# EAGLE design 360 led stick 5 layer (EAGLE 9.6.2)
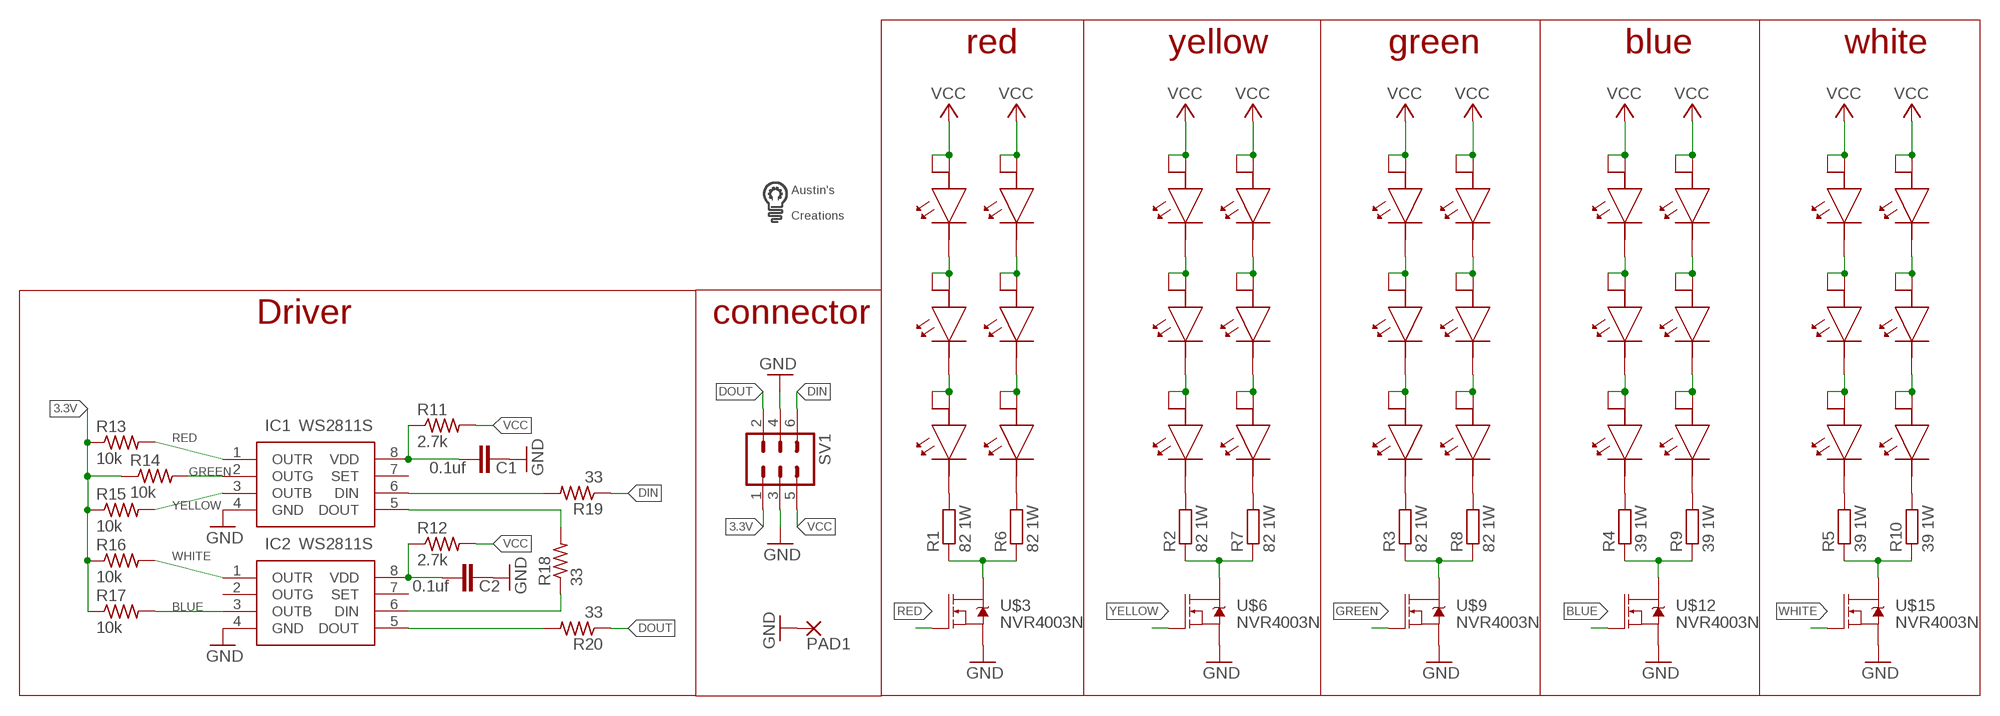
[diagram p0: schematic, sheet 1]

## Parts
C1  0.1uf  C-EUC0603K  [C0603K]
C2  0.1uf  C-EUC0603K  [C0603K]
IC1  WS2811S  [SOIC127P600X175-8N]
IC2  WS2811S  [SOIC127P600X175-8N]
PAD1  WIREPADSMD1,27-254  [SMD1,27-2,54]
R1  82 1W  R-EU_R1210  [R1210]
R2  82 1W  R-EU_R1210  [R1210]
R3  82 1W  R-EU_R1210  [R1210]
R4  39 1W  R-EU_R1210  [R1210]
R5  39 1W  R-EU_R1210  [R1210]
R6  82 1W  R-EU_R1210  [R1210]
R7  82 1W  R-EU_R1210  [R1210]
R8  82 1W  R-EU_R1210  [R1210]
R9  39 1W  R-EU_R1210  [R1210]
R10  39 1W  R-EU_R1210  [R1210]
R11  2.7k  R-US_R0603  [R0603]
R12  2.7k  R-US_R0603  [R0603]
R13  10k  R-US_R0603  [R0603]
R14  10k  R-US_R0603  [R0603]
R15  10k  R-US_R0603  [R0603]
R16  10k  R-US_R0603  [R0603]
R17  10k  R-US_R0603  [R0603]
R18  33  R-US_R0603  [R0603]
R19  33  R-US_R0603  [R0603]
R20  33  R-US_R0603  [R0603]
SV1  MA03-2  [MA03-2]
U$1  5730LED  [5730LED]
U$2  5730LED  [5730LED]
U$3  NVR4003N  [SOT23]
U$4  5730LED  [5730LED]
U$5  5730LED  [5730LED]
U$6  NVR4003N  [SOT23]
U$7  5730LED  [5730LED]
U$8  5730LED  [5730LED]
U$9  NVR4003N  [SOT23]
U$10  5730LED  [5730LED]
U$11  5730LED  [5730LED]
U$12  NVR4003N  [SOT23]
U$13  5730LED  [5730LED]
U$14  5730LED  [5730LED]
U$15  NVR4003N  [SOT23]
U$16  5730LED  [5730LED]
U$17  5730LED  [5730LED]
U$18  5730LED  [5730LED]
U$19  5730LED  [5730LED]
U$20  5730LED  [5730LED]
U$21  LOGO  [LOGO]
U$22  5730LED  [5730LED]
U$23  5730LED  [5730LED]
U$24  5730LED  [5730LED]
U$25  5730LED  [5730LED]
U$26  5730LED  [5730LED]
U$27  5730LED  [5730LED]
U$28  5730LED  [5730LED]
U$29  5730LED  [5730LED]
U$30  5730LED  [5730LED]
U$31  5730LED  [5730LED]
U$32  5730LED  [5730LED]
U$33  5730LED  [5730LED]
U$34  5730LED  [5730LED]
U$35  5730LED  [5730LED]
U$36  5730LED  [5730LED]

## Nets
3.3V: R13.1 R14.1 R15.1 R16.1 R17.1 SV1.1
BLUE: IC2.3(OUTB) R17.2 U$12.2(G)
DIN: R19.1 SV1.6
DOUT: R20.1 SV1.2
GND: C1.1 C2.1 IC1.4(GND) IC2.4(GND) PAD1.1(P) SV1.3 SV1.4 U$3.3(S) U$6.3(S) U$9.3(S) U$12.3(S) U$15.3(S)
GREEN: IC1.2(OUTG) R14.2 U$9.2(G)
N$1: U$1.P$2 U$2.P$1 U$2.P$3
N$2: U$2.P$2 U$4.P$1 U$4.P$3
N$3: R1.2 U$4.P$2
N$4: U$5.P$2 U$7.P$1 U$7.P$3
N$5: U$7.P$2 U$8.P$1 U$8.P$3
N$6: R2.2 U$8.P$2
N$7: U$10.P$2 U$11.P$1 U$11.P$3
N$8: U$11.P$2 U$13.P$1 U$13.P$3
N$9: R3.2 U$13.P$2
N$10: U$14.P$2 U$16.P$1 U$16.P$3
N$11: U$16.P$2 U$17.P$1 U$17.P$3
N$12: R4.2 U$17.P$2
N$13: U$18.P$2 U$19.P$1 U$19.P$3
N$14: U$19.P$2 U$20.P$1 U$20.P$3
N$15: R5.2 U$20.P$2
N$16: R1.1 R6.1 U$3.1(D)
N$17: R2.1 R7.1 U$6.1(D)
N$18: R3.1 R8.1 U$9.1(D)
N$19: R4.1 R9.1 U$12.1(D)
N$20: R5.1 R10.1 U$15.1(D)
N$21: U$22.P$2 U$23.P$1 U$23.P$3
N$22: U$23.P$2 U$24.P$1 U$24.P$3
N$23: R6.2 U$24.P$2
N$24: U$25.P$2 U$26.P$1 U$26.P$3
N$25: U$26.P$2 U$27.P$1 U$27.P$3
N$26: R7.2 U$27.P$2
N$27: U$28.P$2 U$29.P$1 U$29.P$3
N$28: U$29.P$2 U$30.P$1 U$30.P$3
N$29: R8.2 U$30.P$2
N$30: U$31.P$2 U$32.P$1 U$32.P$3
N$31: U$32.P$2 U$33.P$1 U$33.P$3
N$32: R9.2 U$33.P$2
N$33: U$34.P$2 U$35.P$1 U$35.P$3
N$34: U$35.P$2 U$36.P$1 U$36.P$3
N$35: R10.2 U$36.P$2
N$39: C1.2 IC1.8(VDD) R11.1
N$40: IC1.6(DIN) R19.2
N$41: IC2.6(DIN) R18.1
N$42: C2.2 IC2.8(VDD) R12.1
N$45: IC1.5(DOUT) R18.2
N$46: IC2.5(DOUT) R20.2
RED: IC1.1(OUTR) R13.2 U$3.2(G)
VCC: R11.2 R12.2 SV1.5 U$1.P$1 U$1.P$3 U$5.P$1 U$5.P$3 U$10.P$1 U$10.P$3 U$14.P$1 U$14.P$3 U$18.P$1 U$18.P$3 U$22.P$1 U$22.P$3 U$25.P$1 U$25.P$3 U$28.P$1 U$28.P$3 U$31.P$1 U$31.P$3 U$34.P$1 U$34.P$3
WHITE: IC2.1(OUTR) R16.2 U$15.2(G)
YELLOW: IC1.3(OUTB) R15.2 U$6.2(G)
Unconnected: IC1.7(SET) IC2.2(OUTG) IC2.7(SET)

## Notes on the sheet
- red | yellow | green | blue | white
- Driver | connector

## Library data of the parts
C1 C2 = rcl:C-EU: CAPACITOR, European symbol; SPICEPREFIX: C
IC1 IC2 = SamacSys_Parts:WS2811S: RGB led driver Source: Datasheet <https://cdn-shop.adafruit.com/datasheets/WS2811.pdf>; DESCRIPTION: RGB led driver; HEIGHT: 1.75mm; MANUFACTURER_NAME: Worldsemi; MANUFACTURER_PART_NUMBER: ws2811s
PAD1 = wirepad:WIREPAD: Wire PAD connect wire on PCB
R1-R10 = resistor:R-EU_: RESISTOR, European symbol
R11-R20 = resistor:R-US_: RESISTOR, American symbol
SV1 = con-lstb:MA03-2: PIN HEADER; OC_FARNELL: unknown; OC_NEWARK: unknown
U$1 U$2 U$4 U$5 U$7 U$8 U$10 U$11 U$13 U$14 U$16-U$20 U$22-U$36 = custom parts:5730LED
U$3 U$6 U$9 U$12 U$15 = custom parts:NVR4003N
U$21 = custom parts:LOGO

## Board
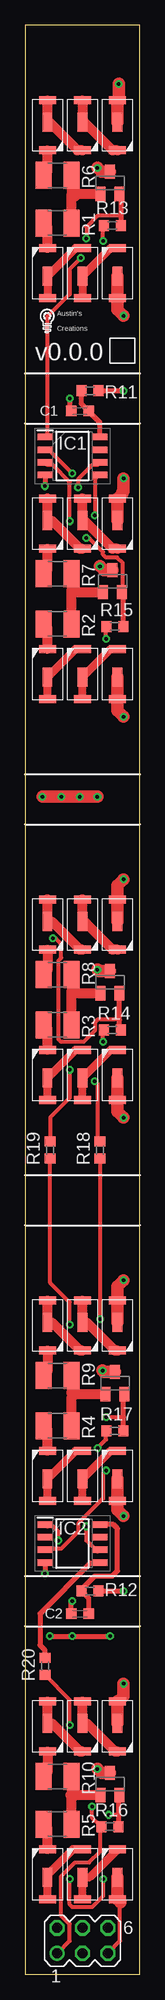
[diagram p1: board, top side]
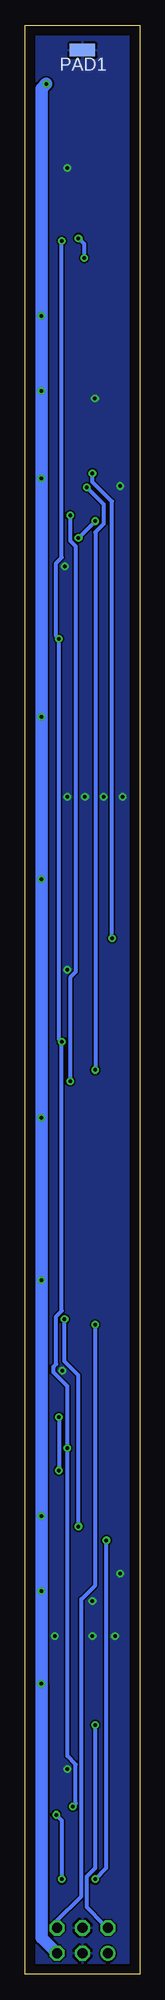
[diagram p2: board, bottom side, seen from below]

Size 11.5 x 194.5 mm. Coordinates in mm from the lower left corner, seen from the top.
Outline: 11.5,0 11.5,194.5 0,194.5 0,0 11.5,0
Copper layers (1*16): Top 0.035mm / dielectric 1.5mm / Bottom 0.035mm
Design rules "default *": minimum track width 16mil, minimum drill 0.35mm, track to track 6mil, track to pad 6mil, pad to pad 6mil, via to via 6mil, smd to smd 6mil, copper to edge 40mil, drill to drill 6mil, minimum pad ring 10mil, minimum via ring 8mil, stop-mask expansion 4mil, vias tented up to drill 0mil, thermal gap 10mil

### Footprints (pad centres in the part's own frame; a part is rotated, then mirrored left to right if it is on the bottom)
C0603K = smd 1.05 x 1.08: 1 -0.875,0; 2 0.875,0
SOIC127P600X175-8N = smd 1.55 x 0.65: 1 -2.725,1.905; 2 -2.725,0.635; 3 -2.725,-0.635; 4 -2.725,-1.905; 5 2.725,-1.905; 6 2.725,-0.635; 7 2.725,0.635; 8 2.725,1.905
SMD1,27-2,54 = smd 1.27 x 2.54: 1 0,0
R1210 = smd 1.6 x 2.7: 1 -1.4,0; 2 1.4,0
R0603 = smd 1 x 1.1: 1 -0.85,0; 2 0.85,0
MA03-2 = drill 1.016: 1 -2.54,-1.27 | drill 1.016 octagon: 2 -2.54,1.27; 3 0,-1.27; 4 0,1.27; 5 2.54,-1.27; 6 2.54,1.27
5730LED = smd 0.813 x 1.676: P$1 -2.5,0; P$2 2.5,0 | smd 1.93 x 0.965: P$3 -0.3,0
SOT23 = smd 1 x 1.4: 1 -0.95,-1.1; 2 0.95,-1.1; 3 0,1.1

### Placement (x,y rotation side)
C1  5.5,156 0 top
C2  5.5,36 0 top
IC1  4.75,151.5 0 top
IC2  4.75,43 0 top
PAD1  5.75,192 90 bottom
R1  3.25,174.75 180 top
R2  3.25,134.75 180 top
R3  3.25,94.75 180 top
R4  3.25,54.75 180 top
R5  3.25,15 180 top
R6  3.25,179.5 180 top
R7  3.25,139.75 180 top
R8  3.25,99.75 180 top
R9  3.25,59.75 180 top
R10  3.25,19.75 180 top
R11  6.5,158 0 top
R12  6.5,38.25 0 top
R13  8.75,174.5 0 top
R14  8.75,94.25 0 top
R15  9,134.5 0 top
R16  8.5,14.75 0 top
R17  9,54.25 0 top
R18  7.5,82.25 90 top
R19  2.5,82.25 90 top
R20  2,30.75 90 top
SV1  5.75,3.38 0 top
U$1  9.25,169.75 90 top
U$2  5.75,169.75 90 top
U$3  8.5,178.75 0 top
U$4  2.25,169.75 90 top
U$5  9.25,129.75 90 top
U$6  8.75,139 0 top
U$7  5.75,129.75 90 top
U$8  2.25,129.75 90 top
U$9  8.5,99 0 top
U$10  9.25,89.75 90 top
U$11  5.75,89.75 90 top
U$12  9,59 0 top
U$13  2.25,89.75 90 top
U$14  9.25,49.75 90 top
U$15  8.5,19 0 top
U$16  5.75,49.75 90 top
U$17  2.25,49.75 90 top
U$18  9.25,10 90 top
U$19  5.75,10 90 top
U$20  2.25,10 90 top
U$21  1.5,163.75 0 top
U$22  9.25,184.5 270 top
U$23  5.75,184.5 270 top
U$24  2.25,184.5 270 top
U$25  9.25,144.75 270 top
U$26  5.75,144.75 270 top
U$27  2.25,144.75 270 top
U$28  9.25,104.75 270 top
U$29  5.75,104.75 270 top
U$30  2.25,104.75 270 top
U$31  9.25,64.75 270 top
U$32  5.75,64.75 270 top
U$33  2.25,64.75 270 top
U$34  9.25,24.75 270 top
U$35  5.75,24.75 270 top
U$36  2.25,24.75 270 top

### Tracks (layer width: path | path; a pad name or v marks a point on that pad's centre or on a via)
3.3V  (via drill 0.35)
  Top 0.406: SV1.1 3.35,2.23 4.47,3.35 4.47,5.03 3.63,5.87 3.63,9.78 5.03,11.18 6.43,11.18 7.54,12.29 7.54,14.53 R16.1 7.54,14.81 6.71,15.65 v6.71,16.76 | v7.26,52.53 8.1,53.37 8.1,54.2 R17.1 | v7.82,93.04 7.82,94.16 R14.1 | v8.1,133.27 8.1,134.39 R15.1 | v7.82,172.95 7.82,174.35 R13.1
  Bottom 0.406: v6.71,16.76 6.43,17.04 6.43,20.95 7.26,21.79 v7.26,52.53 7.26,58.67 8.66,60.07 8.66,60.63 8.38,60.91 8.38,65.66 7.82,66.22 v7.82,93.04 8.1,93.32 v8.1,133.27 8.38,133.55 8.38,140.82 7.82,141.38 v7.82,172.95
BLUE  (via drill 0.35)
  Top 0.406: v8.1,50.29 7.82,50.01 7.82,47.5 5.31,44.98 5.31,44.15 3.63,42.47 2.23,42.47 IC2.3 | 9.85,55.6 v8.1,55.6
  Top 0.508: R17.2 9.85,55.6 9.85,57.8 U$12.2
  Bottom 0.406: v8.1,55.6 v8.1,50.29
DIN  (via drill 0.35)
  Top 0.406: v4.47,64.82 4.47,67.06 2.52,69.01 2.52,81.31 R19.1
  Bottom 0.406: v4.47,64.82 4.47,38.84 5.87,37.44 5.87,7.82 8.38,5.31 8.38,4.75 SV1.6
DOUT  (via drill 0.35)
  Top 0.406: v4.47,24.87 4.47,27.38 R20.1
  Bottom 0.406: v4.47,24.87 4.47,10.62 5.31,9.78 5.31,6.71 3.63,5.03 3.35,5.03 3.07,4.75 SV1.2
GND  (via drill 0.35)
  Top 0.508: IC1.4 2.02,148.53 v2,148.5 | C1.1 4.5,156.12 v4.5,157.25 | IC2.4 2.02,40.02 v2,40 | C2.1 4.62,37.12 v4.75,37.25 | v2.5,33.75 v4.75,33.75 v8.5,33.75
  Top 1.27: U$15.3 7.65,20.1 v7.25,20.5 | U$3.3 7.65,179.85 v7.25,180.25 | U$6.3 7.9,140.1 v7.5,140.5 | U$9.3 7.4,100.1 v7.25,100.25 | U$12.3 7.9,60.1 v7.75,60.25 | v1.75,117.5 v3.62,117.5 v5.5,117.5 v7.25,117.5
  pour Bottom: 0,194.5 0,0 11.5,0 11.5,194.5
GREEN  (via drill 0.35)
  Top 0.406: v4.75,149.76 2.52,151.99 2.23,151.99 IC1.2 | v2.79,103.38 3.07,103.38 3.63,102.82 3.63,101.42 3.35,101.14 3.35,93.32 3.63,93.04 5.87,93.04 6.99,94.16 6.99,95 7.26,95.28 9.45,95.28
  Top 0.508: R14.2 9.45,94.4 9.45,95.28 U$9.2
  Bottom 0.406: v4.75,149.76 4.75,148.92 2.79,146.96 v2.79,103.38
N$1
  Top 0.813: U$2.P$1 U$2.P$3 8.55,172.25 U$1.P$2
N$2
  Top 0.813: U$4.P$1 U$4.P$3 5.05,172.25 U$2.P$2
N$3
  Top 1.016: U$4.P$2 2.25,174.35 R1.2
N$4
  Top 0.813: U$7.P$1 U$7.P$3 8.55,132.25 U$5.P$2
N$5
  Top 0.813: U$8.P$1 U$8.P$3 5.05,132.25 U$7.P$2
N$6
  Top 1.016: U$8.P$2 2.25,134.35 R2.2
N$7
  Top 0.813: U$11.P$1 U$11.P$3 8.55,92.25 U$10.P$2
N$8
  Top 0.813: U$13.P$1 U$13.P$3 5.05,92.25 U$11.P$2
N$9
  Top 1.016: U$13.P$2 2.25,94.35 R3.2
N$10
  Top 0.813: U$16.P$1 U$16.P$3 8.55,52.25 U$14.P$2
N$11
  Top 0.813: U$17.P$1 U$17.P$3 5.05,52.25 U$16.P$2
N$12
  Top 1.016: U$17.P$2 2.25,54.35 R4.2
N$13
  Top 0.813: U$19.P$1 U$19.P$3 6.5,9.7 9.25,12.45 U$18.P$2
N$14
  Top 0.813: U$20.P$1 U$20.P$3 2.25,9.95 4.8,12.5 U$19.P$2
N$15
  Top 1.016: U$20.P$2 2.25,14.6 R5.2
N$16
  Top 1.016: 4.8,177.4 4.65,177.25 R1.1 | 4.8,177.4 5.05,177.4 5.3,177.65 U$3.1 | R6.1 4.65,177.55 4.8,177.4
N$17
  Top 1.016: 4.8,137.9 4.65,137.75 R2.1 | 4.8,137.9 U$6.1 | R7.1 4.65,138.05 4.8,137.9
N$18
  Top 1.016: R3.1 4.65,97.75 4.8,97.9 | 4.8,97.9 U$9.1 | R8.1 4.65,98.05 4.8,97.9
N$19
  Top 1.016: 5.05,57.9 4.65,57.5 R4.1 | 5.05,57.9 4.8,57.9 4.65,58.05 R9.1 | 5.05,57.9 U$12.1
N$20
  Top 1.016: R5.1 4.65,17.65 4.8,17.65 4.65,17.8 | U$15.1 4.55,17.9 4.65,17.8 | R10.1 4.65,17.8
N$21
  Top 1.016: U$23.P$1 U$23.P$3 5.95,184.8 8.75,182 U$22.P$2
N$22
  Top 1.016: U$24.P$1 U$24.P$3 2.45,184.8 5.25,182 U$23.P$2
N$23
  Top 1.016: R6.2 2.25,179.9 U$24.P$2
N$24
  Top 1.016: U$26.P$1 U$26.P$3 5.95,145.05 8.75,142.25 U$25.P$2
N$25
  Top 1.016: U$27.P$1 U$27.P$3 2.7,145.05 5.5,142.25 U$26.P$2
N$26
  Top 1.016: R7.2 2.25,140.15 U$27.P$2
N$27
  Top 1.016: U$29.P$1 U$29.P$3 5.95,105.05 8.75,102.25 U$28.P$2
N$28
  Top 1.016: U$30.P$1 U$30.P$3 2.7,105.05 5.5,102.25 U$29.P$2
N$29
  Top 1.016: U$30.P$2 2.25,100.15 R8.2
N$30
  Top 1.016: U$32.P$1 U$32.P$3 6.2,65.05 9,62.25 U$31.P$2
N$31
  Top 1.016: U$33.P$1 U$33.P$3 2.7,65.05 5.5,62.25 U$32.P$2
N$32
  Top 1.016: U$33.P$2 2.25,60.15 R9.2
N$33
  Top 1.016: U$34.P$2 9,22.25 6.2,25.05 U$35.P$3 U$35.P$1
N$34
  Top 1.016: U$35.P$2 5.5,22.25 2.7,25.05 U$36.P$3 U$36.P$1
N$35
  Top 1.016: U$36.P$2 2.25,20.15 R10.2
N$39
  Top 0.508: IC1.8 7.47,154.9 C1.2 5.65,156.72 R11.1
N$40  (via drill 0.35)
  Top 0.406: v4.47,90.25 4.47,87.45 2.52,85.5 2.52,83.26 R19.2 | v5.31,148.36 5.31,149.2 6.71,150.6 7.26,150.6 IC1.6
  Bottom 0.406: v4.47,90.25 4.47,143.89 3.63,144.73 3.63,146.69 v5.31,148.36
N$41  (via drill 0.35)
  Top 0.406: v7.54,65.38 7.54,81.31 R18.1 | v6.15,44.7 6.15,43.31 7.26,42.19 IC2.6
  Bottom 0.406: v7.54,65.38 7.54,61.19 6.15,59.79 v6.15,44.7
N$42
  Top 0.508: C2.2 6.38,37.52 R12.1 5.65,38.4 7,39.75 8.75,39.75 9.25,40.25 9.25,44.5 8.85,44.91 IC2.8
N$45  (via drill 0.35)
  Top 0.406: v6.99,89.13 7.26,88.85 7.26,83.26 R18.2 | v6.99,145.57 6.99,149.2 7.26,149.48 IC1.5
  Bottom 0.406: v6.99,89.13 6.99,99.47 6.43,100.03 6.43,142.49 6.99,143.05 v6.99,145.57
N$46
  Top 0.508: IC2.5 7.38,41 6.5,41 1.5,36 1.5,32.85 2,32.35 R20.2
RED  (via drill 0.35)
  Top 0.406: v5.59,171.27 4.47,170.16 4.47,167.64 2.23,165.41 2.23,153.67 IC1.1 | v6.15,173.23 6.15,174.35 7.26,175.46 9.6,175.46
  Top 0.508: U$3.2 9.6,177.5 9.6,175.46 R13.2
  Bottom 0.406: v5.59,171.27 5.59,172.67 v6.15,173.23
VCC  (via drill 0.35)
  Top 0.406: 9.56,7.19 9.5,6.71 9.5,3.35 8.38,2.23 SV1.5
  Top 0.508: R11.2 v9.85,158 | R12.2 v9.85,38.25
  Top 1.27: 9.56,7.19 U$18.P$1 U$18.P$3 | v9.38,188.62 9.38,187.12 U$22.P$1 U$22.P$3 | v9.85,165.5 9.25,166.1 U$1.P$1 U$1.P$3 | v9.85,149.25 9.85,148 9.75,147.9 9.75,147.75 U$25.P$1 U$25.P$3 | U$5.P$3 U$5.P$1 9.25,126.1 v9.85,125.5 | U$28.P$3 U$28.P$1 9.25,108.65 v9.85,109.25 | U$10.P$3 U$10.P$1 9.25,86.1 v9.85,85.5 | U$31.P$3 U$31.P$1 9.25,68.65 v9.85,69.25 | U$14.P$3 U$14.P$1 9.25,46.35 v9.85,45.75 | U$34.P$3 U$34.P$1 9.35,27.25 9.85,27.75 v9.85,29
  Bottom 1.27: v9.38,188.62 9.85,188.15 v9.85,165.5 v9.85,158 v9.85,149.25 v9.85,125.5 v9.85,109.25 v9.85,85.5 v9.85,69.25 v9.85,45.75 v9.85,38.25 v9.85,29 9.85,3.66 SV1.5
WHITE  (via drill 0.35)
  Top 0.406: v3.35,43.31 3.35,44.15 2.79,44.7 2.23,44.7 IC2.1 | v4.47,9.5 4.47,6.99 4.75,6.71 6.71,6.71 7.82,7.82 v7.82,9.5 | 9.35,15.93 v8.38,15.93
  Top 0.508: U$15.2 9.35,17.8 9.35,15.93 R16.2
  Bottom 0.406: v3.35,43.31 3.35,10.62 v4.47,9.5 | v7.82,9.5 7.82,15.37 v8.38,15.93
YELLOW  (via drill 0.35)
  Top 0.406: v4.47,145.01 4.47,148.92 2.79,150.6 2.23,150.6 IC1.3 | v6.15,143.33 6.43,143.33 7.82,141.94 7.82,141.66 8.1,141.38 9.22,141.38 9.78,140.82 9.78,138.02 U$6.2
  Top 0.508: R15.2 9.85,137.75 U$6.2
  Bottom 0.406: v6.15,143.33 v4.47,145.01

### Text on the board
tNames: v0.0.0